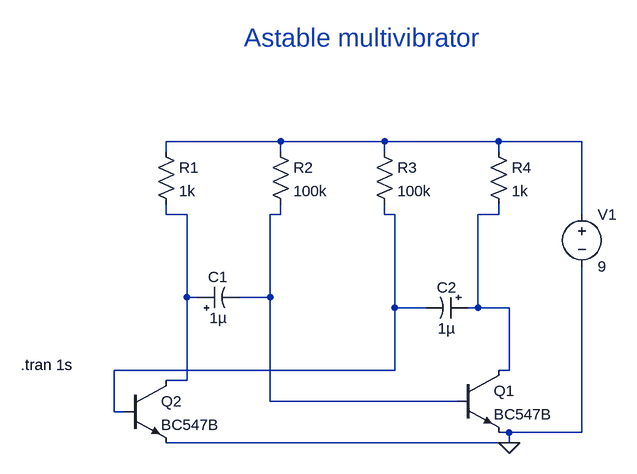
[diagram p0: schematic Astable-multivibrator.asc]
Astable-multivibrator.asc, the LTspice schematic file:
Version 4.1
SHEET 1 1088 680
WIRE 352 384 368 384
WIRE -160 400 -144 400
WIRE 480 128 480 144
WIRE 368 384 480 384
WIRE 480 384 480 144
WIRE 368 384 368 400
WIRE 368 400 -144 400
FLAG 368 400 0
WIRE -160 -48 -160 -64
WIRE 16 -48 16 -64
WIRE 176 -48 176 -64
WIRE 352 -48 352 -64
WIRE 480 48 480 32
WIRE -160 -64 16 -64
WIRE 16 -64 176 -64
WIRE 176 -64 352 -64
WIRE 352 -64 480 -64
WIRE 480 -64 480 32
WIRE -112 176 -128 176
WIRE -160 304 -144 304
WIRE -160 32 -160 48
WIRE -128 176 -128 304
WIRE -128 304 -144 304
WIRE -128 176 -128 48
WIRE -128 48 -160 48
WIRE -48 176 0 176
WIRE 288 336 272 336
WIRE 16 32 16 48
WIRE 0 176 0 48
WIRE 0 48 16 48
WIRE 0 176 0 336
WIRE 0 336 272 336
WIRE 240 192 192 192
WIRE -224 352 -240 352
WIRE 176 32 176 48
WIRE 192 192 192 48
WIRE 192 48 176 48
WIRE 192 192 192 288
WIRE 192 288 -240 288
WIRE -240 288 -240 352
WIRE 304 192 320 192
WIRE 352 288 368 288
WIRE 352 32 352 48
WIRE 320 192 368 192
WIRE 368 192 368 288
WIRE 320 192 320 48
WIRE 320 48 352 48
SYMBOL res -176 -64 R0
SYMATTR InstName R1
SYMATTR Value 1k
SYMBOL res 0 -64 R0
SYMATTR InstName R2
SYMATTR Value 100k
SYMBOL res 160 -64 R0
SYMATTR InstName R3
SYMATTR Value 100k
SYMBOL res 336 -64 R0
SYMATTR InstName R4
SYMATTR Value 1k
SYMBOL npn 288 288 R0
SYMATTR InstName Q1
SYMATTR Value BC547B
SYMBOL npn -224 304 R0
SYMATTR InstName Q2
SYMATTR Value BC547B
SYMBOL voltage 480 32 R0
WINDOW 123 0 0 Left 2
WINDOW 39 0 0 Left 2
SYMATTR InstName V1
SYMATTR Value 9
SYMBOL polcap -112 192 R270
WINDOW 0 32 32 VTop 2
WINDOW 3 0 32 VBottom 2
SYMATTR InstName C1
SYMATTR Value 1µ
SYMBOL polcap 304 176 R90
WINDOW 0 0 32 VBottom 2
WINDOW 3 32 32 VTop 2
SYMATTR InstName C2
SYMATTR Value 1µ
TEXT -384 280 Left 2 !.tran 1s
TEXT -40 -224 Left 4 ;Astable multivibrator

The netlist it stands for:
* Astable-multivibrator.asc
R1 N001 N002 1k
R2 N001 N003 100k
R3 N001 N004 100k
R4 N001 N005 1k
Q1 N005 N003 0 0 BC547B
Q2 N002 N004 0 0 BC547B
V1 N001 0 9
C1 N002 N003 1µ
C2 N005 N004 1µ
.model NPN NPN
.model PNP PNP
.lib standard.bjt
.tran 1s
* Astable multivibrator
.backanno
.end